# Altium project LoRaWAN Senior Project.PrjPcb
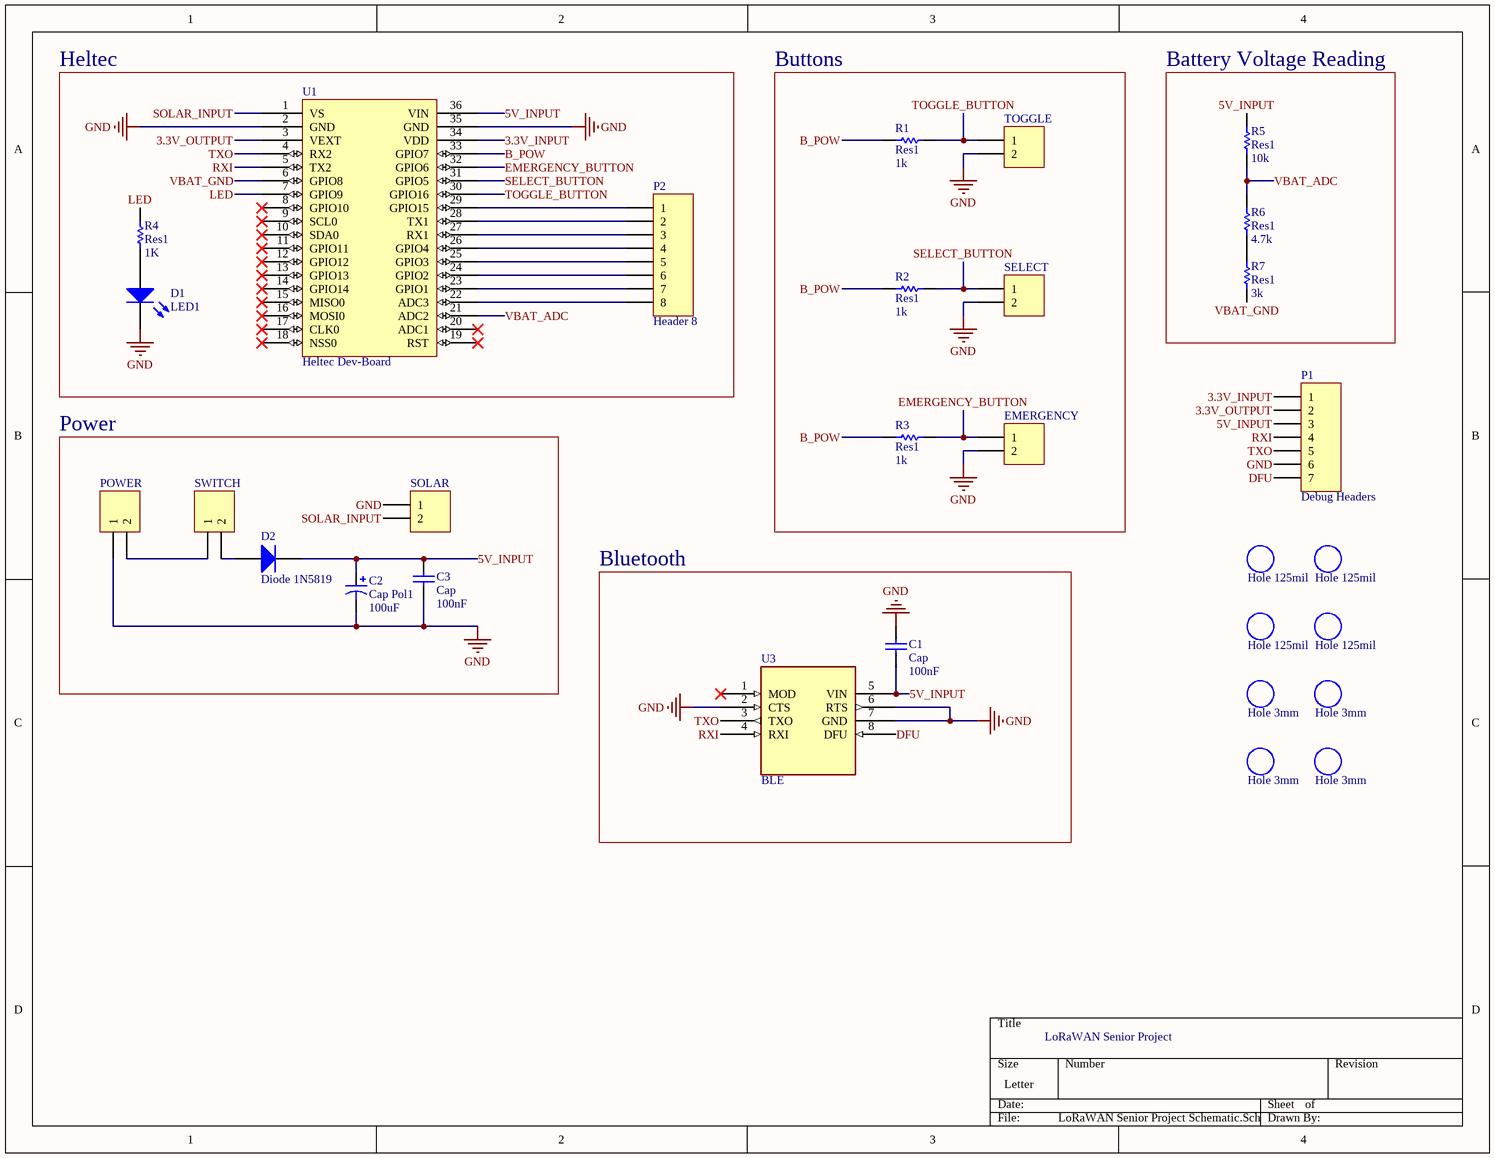
[diagram p0: LoRaWAN Senior Project Schematic.SchDoc]
1 sheet, 30 parts. Net scope: global (net labels, ports and power ports of the same name join across sheets).
Board file: LoRaWAN Senior Project PCB.PcbDoc

## Sheet LoRaWAN Senior Project Schematic.SchDoc
size Letter; SheetNumber: 1; SheetTotal: 1; SPICEModelCacheQPXBXETC: <root> / <DocumentId>QPXBXETC</DocumentId> / <CacheFrame Number="0"> / <Model Name="cap" Kind="MDL"> / <Text>*Default semiconductor capacitor / .MODEL CAP C()</Text> / </Model> / <Model Name="led1" Kind="MDL"> / <Text>*Typ RED GaAs LED: Vf=1.7V Vr=4V If=40mA trr=3uS / *LED Pinout: 1=A, 2=K / .MODEL LED1 D (IS=93.2P RS=42M N=3.73 BV=4 IBV=10U / + CJO=2.97P VJ=.75 M=.333 TT=4.32U)</Text> / </Model> / <Model Name="1n4001" Kind="MDL"> / <Text>*1N4001 MCE 8-16-95 / *50V 1A Si GenPurpose Diode pkg:DIODE0.4 1,2 / .MODEL 1N4001 D(IS=2.55E-9 RS=0.042 N=1.75 TT=5.76E-6 CJO=1.85E-11 / + VJ=0.75 M=0.333 BV=50 IBV=1E-5 )</Text> / </Model> / </CacheFrame> / </root>

### Parts
C1  Cap  value 100nF  [RAD-0.1]
C2  Cap Pol1  value 100uF  [RAD-0.2]
C3  Cap  value 100nF  [RAD-0.1]
D1  LED1  [LED-1]
D2  Diode 1N5819  [DO-41]
EMERGENCY  Button Port  [CON2screw]  (value not drawn)
H1  Hole 125mil  [Hole 125mil]
H2  Hole 125mil  [Hole 125mil]
H3  Hole 125mil  [Hole 125mil]
H4  Hole 125mil  [Hole 125mil]
H5  Hole 3mm  [Hole 3mm]
H6  Hole 3mm  [Hole 3mm]
H7  Hole 3mm  [Hole 3mm]
H8  Hole 3mm  [Hole 3mm]
P1  Debug Headers  [HDR1X7]
P2  Header 8  [HDR1X8]
POWER  Power Port  [CON2screw]  (value not drawn)
R1  Res1  value 1k  [RESISTOR]
R2  Res1  value 1k  [RESISTOR]
R3  Res1  value 1k  [RESISTOR]
R4  Res1  value 1K  [AXIAL-0.3]
R5  Res1  value 10k  [RESISTOR]
R6  Res1  value 4.7k  [RESISTOR]
R7  Res1  value 3k  [RESISTOR]
SELECT  Button Port  [CON2screw]  (value not drawn)
SOLAR  Solar Port  [CON2screw]  (value not drawn)
SWITCH  Switch Port  [CON2screw]  (value not drawn)
TOGGLE  Button Port  [CON2screw]  (value not drawn)
U1  Heltec Dev-Board  [HELTEC]
U3  BLE  [Adafruit BLE]

### Blocks framed on the sheet
Heltec: D1 P2 R4 U1
Buttons: EMERGENCY R1-R3 SELECT TOGGLE
Battery Voltage Reading: R5-R7
Power: C2 C3 D2 POWER SOLAR SWITCH
Bluetooth: C1 U3

### Nets
GND: C1.1 C2.2 C3.1 D1.2(K) EMERGENCY.2 P1.6 POWER.1 SELECT.2 SOLAR.1 TOGGLE.2 U1.2(GND) U1.35(GND) U3.2(CTS) U3.6(RTS) U3.7(GND)
3.3V_INPUT: P1.1 U1.34(VDD)
3.3V_OUTPUT: P1.2 U1.3(VEXT)
5V_INPUT: C1.2 C2.1 C3.2 D2.2(K) P1.3 R5.2 U1.36(VIN) U3.5(VIN)
B_POW: R1.1 R2.1 R3.1 U1.33(GPIO7)
DFU: P1.7 U3.8(DFU)
EMERGENCY_BUTTON: EMERGENCY.1 R3.2 U1.32(GPIO6)
LED: R4.2 U1.7(GPIO9)
RXI: P1.4 U1.5(TX2) U3.4(RXI)
SELECT_BUTTON: R2.2 SELECT.1 U1.31(GPIO5)
SOLAR_INPUT: SOLAR.2 U1.1(VS)
TOGGLE_BUTTON: R1.2 TOGGLE.1 U1.30(GPIO16)
TXO: P1.5 U1.4(RX2) U3.3(TXO)
VBAT_ADC: R5.1 R6.2 U1.21(ADC2)
VBAT_GND: R7.1 U1.6(GPIO8)
NetD1_1: D1.1(A) R4.1
NetD2_1: D2.1(A) SWITCH.2
NetP2_1: P2.1 U1.29(GPIO15)
NetP2_2: P2.2 U1.28(TX1)
NetP2_3: P2.3 U1.27(RX1)
NetP2_4: P2.4 U1.26(GPIO4)
NetP2_5: P2.5 U1.25(GPIO3)
NetP2_6: P2.6 U1.24(GPIO2)
NetP2_7: P2.7 U1.23(GPIO1)
NetP2_8: P2.8 U1.22(ADC3)
NetPOWER_2: POWER.2 SWITCH.1
NetR6_1: R6.1 R7.2

Not connected (* = marked no-connect by the designer): U1 8(GPIO10)* 9(SCL0)* 10(SDA0)* 11(GPIO11)* 12(GPIO12)* 13(GPIO13)* 14(GPIO14)* 15(MISO0)* 16(MOSI0)* 17(CLK0)* 18(NSS0)* 19(RST)* 20(ADC1)*; U3 1(MOD)*

### Notes on the sheet
- LoRaWAN Senior Project

### Library data of the parts
C1 C3 = Cap: Capacitor; Published: 8-Jun-2000; LatestRevisionDate: 17-Jul-2002; LatestRevisionNote: Re-released for DXP Platform.; PackageReference: RAD-0.3; Publisher: Altium Limited; PackageDescription: Radial Cap, Thru-Hole; 2 Leads; 0.3 in Pin Spacing
C2 = Cap Pol1: Polarized Capacitor (Radial); Published: 8-Jun-2000; LatestRevisionDate: 17-Jul-2002; LatestRevisionNote: Re-released for DXP Platform.; PackageReference: RB7.6-15; Publisher: Altium Limited; PackageDescription: Polarized Capacitor (Radial); 2 Leads
D1 = LED1: Typical RED GaAs LED; Published: 8-Jun-2000; LatestRevisionDate: 08-Jul-2005; LatestRevisionNote: Mech Layer 1 removed.; PackageReference: LED-1; Publisher: Altium Limited; PackageDescription: LED; 2 Leads
D2 = Diode 1N4001: 1 Amp General Purpose Rectifier; Published: 8-Jun-2000; LatestRevisionDate: 17-Jul-2002; LatestRevisionNote: Re-released for DXP Platform.; DatasheetVersion: 1998; PackageVersion: Aug-1999; PackageReference: DO-41; Publisher: Altium Limited; PackageDescription: Diode, Axial; Body 5.2 x 2.7 mm (LxDia. max), Lead Dia. 0.86 mm (max); Code_JEDEC: DO-204-AL; ComponentLink1Description: Manufacturer Link; ComponentLink1URL: http://www.fairchildsemi.com/; ComponentLink2Description: Datasheet; ComponentLink2URL: http://www.fairchildsemi.com/ds/1N%2F1N4001.pdf
EMERGENCY POWER SELECT SOLAR SWITCH TOGGLE = Power
P1 = Header 7: Header, 7-Pin; LatestRevisionDate: 17-Jul-2002; LatestRevisionNote: Re-released for DXP Platform.; Publisher: Altium Limited
P2 = Header 8: Header, 8-Pin; LatestRevisionDate: 17-Jul-2002; LatestRevisionNote: Re-released for DXP Platform.; Publisher: Altium Limited
R1-R7 = Res1: Resistor; Published: 8-Jun-2000; LatestRevisionDate: 17-Jul-2002; LatestRevisionNote: Re-released for DXP Platform.; PackageReference: AXIAL-0.3; Publisher: Altium Limited; PackageDescription: Axial Device, Thru-Hole; 2 Leads; 0.3 in Pin Spacing
U3 = Adafruit BLE